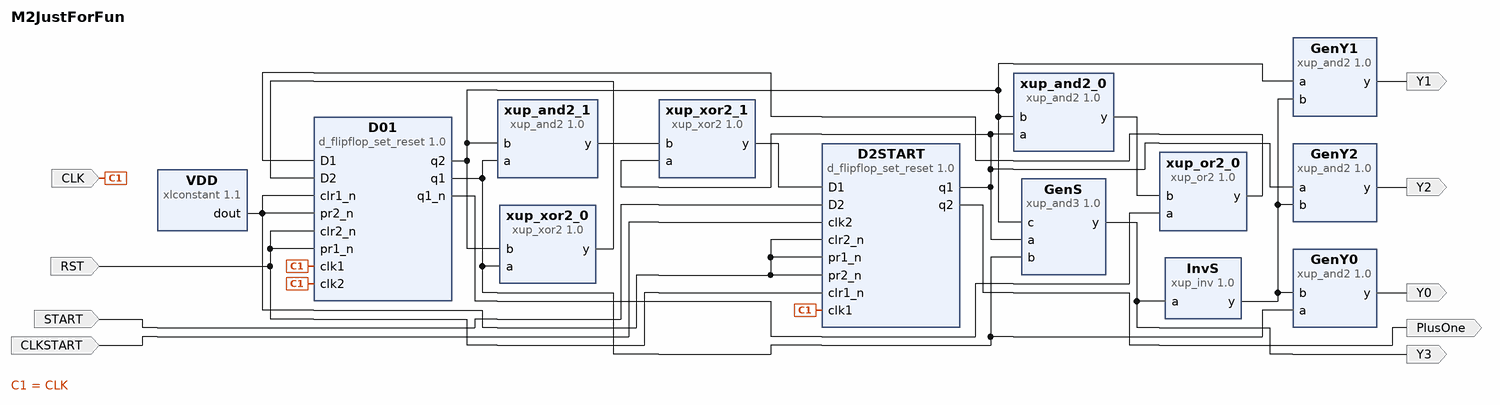
[diagram p0: block diagram of the top level]
# Vivado block design M2JustForFun, xc7a35tcpg236-1, Vivado 2017.2
create_bd_design M2JustForFun

create_bd_port -dir I CLK
create_bd_port -dir I START
create_bd_port -dir I CLKSTART
create_bd_port -dir I RST
create_bd_port -dir O Y0
create_bd_port -dir O Y1
create_bd_port -dir O Y2
create_bd_port -dir O Y3
create_bd_port -dir O PlusOne

create_bd_cell -type ip -vlnv xilinx.com:XUP:d_flipflop_set_reset:1.0 D01
create_bd_cell -type ip -vlnv xilinx.com:XUP:d_flipflop_set_reset:1.0 D2START
create_bd_cell -type ip -vlnv xilinx.com:xup:xup_and2:1.0 xup_and2_0
create_bd_cell -type ip -vlnv xilinx.com:xup:xup_or2:1.0 xup_or2_0
create_bd_cell -type ip -vlnv xilinx.com:xup:xup_xor2:1.0 xup_xor2_0
create_bd_cell -type ip -vlnv xilinx.com:xup:xup_and2:1.0 xup_and2_1
create_bd_cell -type ip -vlnv xilinx.com:xup:xup_xor2:1.0 xup_xor2_1
create_bd_cell -type ip -vlnv xilinx.com:xup:xup_and3:1.0 GenS
create_bd_cell -type ip -vlnv xilinx.com:xup:xup_inv:1.0 InvS
create_bd_cell -type ip -vlnv xilinx.com:xup:xup_and2:1.0 GenY1
create_bd_cell -type ip -vlnv xilinx.com:xup:xup_and2:1.0 GenY2
create_bd_cell -type ip -vlnv xilinx.com:xup:xup_and2:1.0 GenY0
create_bd_cell -type ip -vlnv xilinx.com:ip:xlconstant:1.1 VDD

# ---- connections ----

connect_bd_net [get_bd_pins xup_and2_0/y] [get_bd_pins xup_or2_0/b]
connect_bd_net [get_bd_pins xup_or2_0/y] [get_bd_pins D01/D1]
connect_bd_net [get_bd_pins xup_xor2_0/y] [get_bd_pins D01/D2]
connect_bd_net [get_bd_pins D2START/q1] [get_bd_pins xup_and2_0/a] [get_bd_pins xup_xor2_1/a] [get_bd_pins GenS/a] [get_bd_pins GenY2/a]
connect_bd_net [get_bd_pins D01/q2] \
  [get_bd_pins xup_and2_0/b] [get_bd_pins xup_xor2_0/b] [get_bd_pins xup_and2_1/b] [get_bd_pins GenS/c] [get_bd_pins GenY1/a]
connect_bd_net [get_bd_pins D01/q1_n] [get_bd_pins xup_or2_0/a]
connect_bd_net [get_bd_pins D01/q1] [get_bd_pins xup_xor2_0/a] [get_bd_pins xup_and2_1/a] [get_bd_pins GenS/b] [get_bd_pins GenY0/a]
connect_bd_net [get_bd_pins xup_and2_1/y] [get_bd_pins xup_xor2_1/b]
connect_bd_net [get_bd_pins xup_xor2_1/y] [get_bd_pins D2START/D1]
connect_bd_net -net xup_and3_0_y [get_bd_pins GenS/y] [get_bd_pins InvS/a] [get_bd_ports Y3]
connect_bd_net -net xup_inv_0_y [get_bd_pins InvS/y] [get_bd_pins GenY0/b] [get_bd_pins GenY1/b] [get_bd_pins GenY2/b]
connect_bd_net [get_bd_ports CLK] [get_bd_pins D01/clk2] [get_bd_pins D2START/clk1] [get_bd_pins D01/clk1]
connect_bd_net [get_bd_ports START] [get_bd_pins D2START/D2]
connect_bd_net [get_bd_ports CLKSTART] [get_bd_pins D2START/clk2]
connect_bd_net [get_bd_pins VDD/dout] \
  [get_bd_pins D01/clr1_n] [get_bd_pins D01/pr2_n] [get_bd_pins D2START/pr1_n] [get_bd_pins D2START/pr2_n] \
  [get_bd_pins D2START/clr2_n]
connect_bd_net [get_bd_ports RST] [get_bd_pins D01/pr1_n] [get_bd_pins D01/clr2_n] [get_bd_pins D2START/clr1_n]
connect_bd_net [get_bd_pins GenY0/y] [get_bd_ports Y0]
connect_bd_net [get_bd_pins GenY1/y] [get_bd_ports Y1]
connect_bd_net [get_bd_pins GenY2/y] [get_bd_ports Y2]
connect_bd_net [get_bd_pins D2START/q2] [get_bd_ports PlusOne]

validate_bd_design
save_bd_design
